# EAGLE design Set-Mile-TOP (EAGLE 9.6.2)
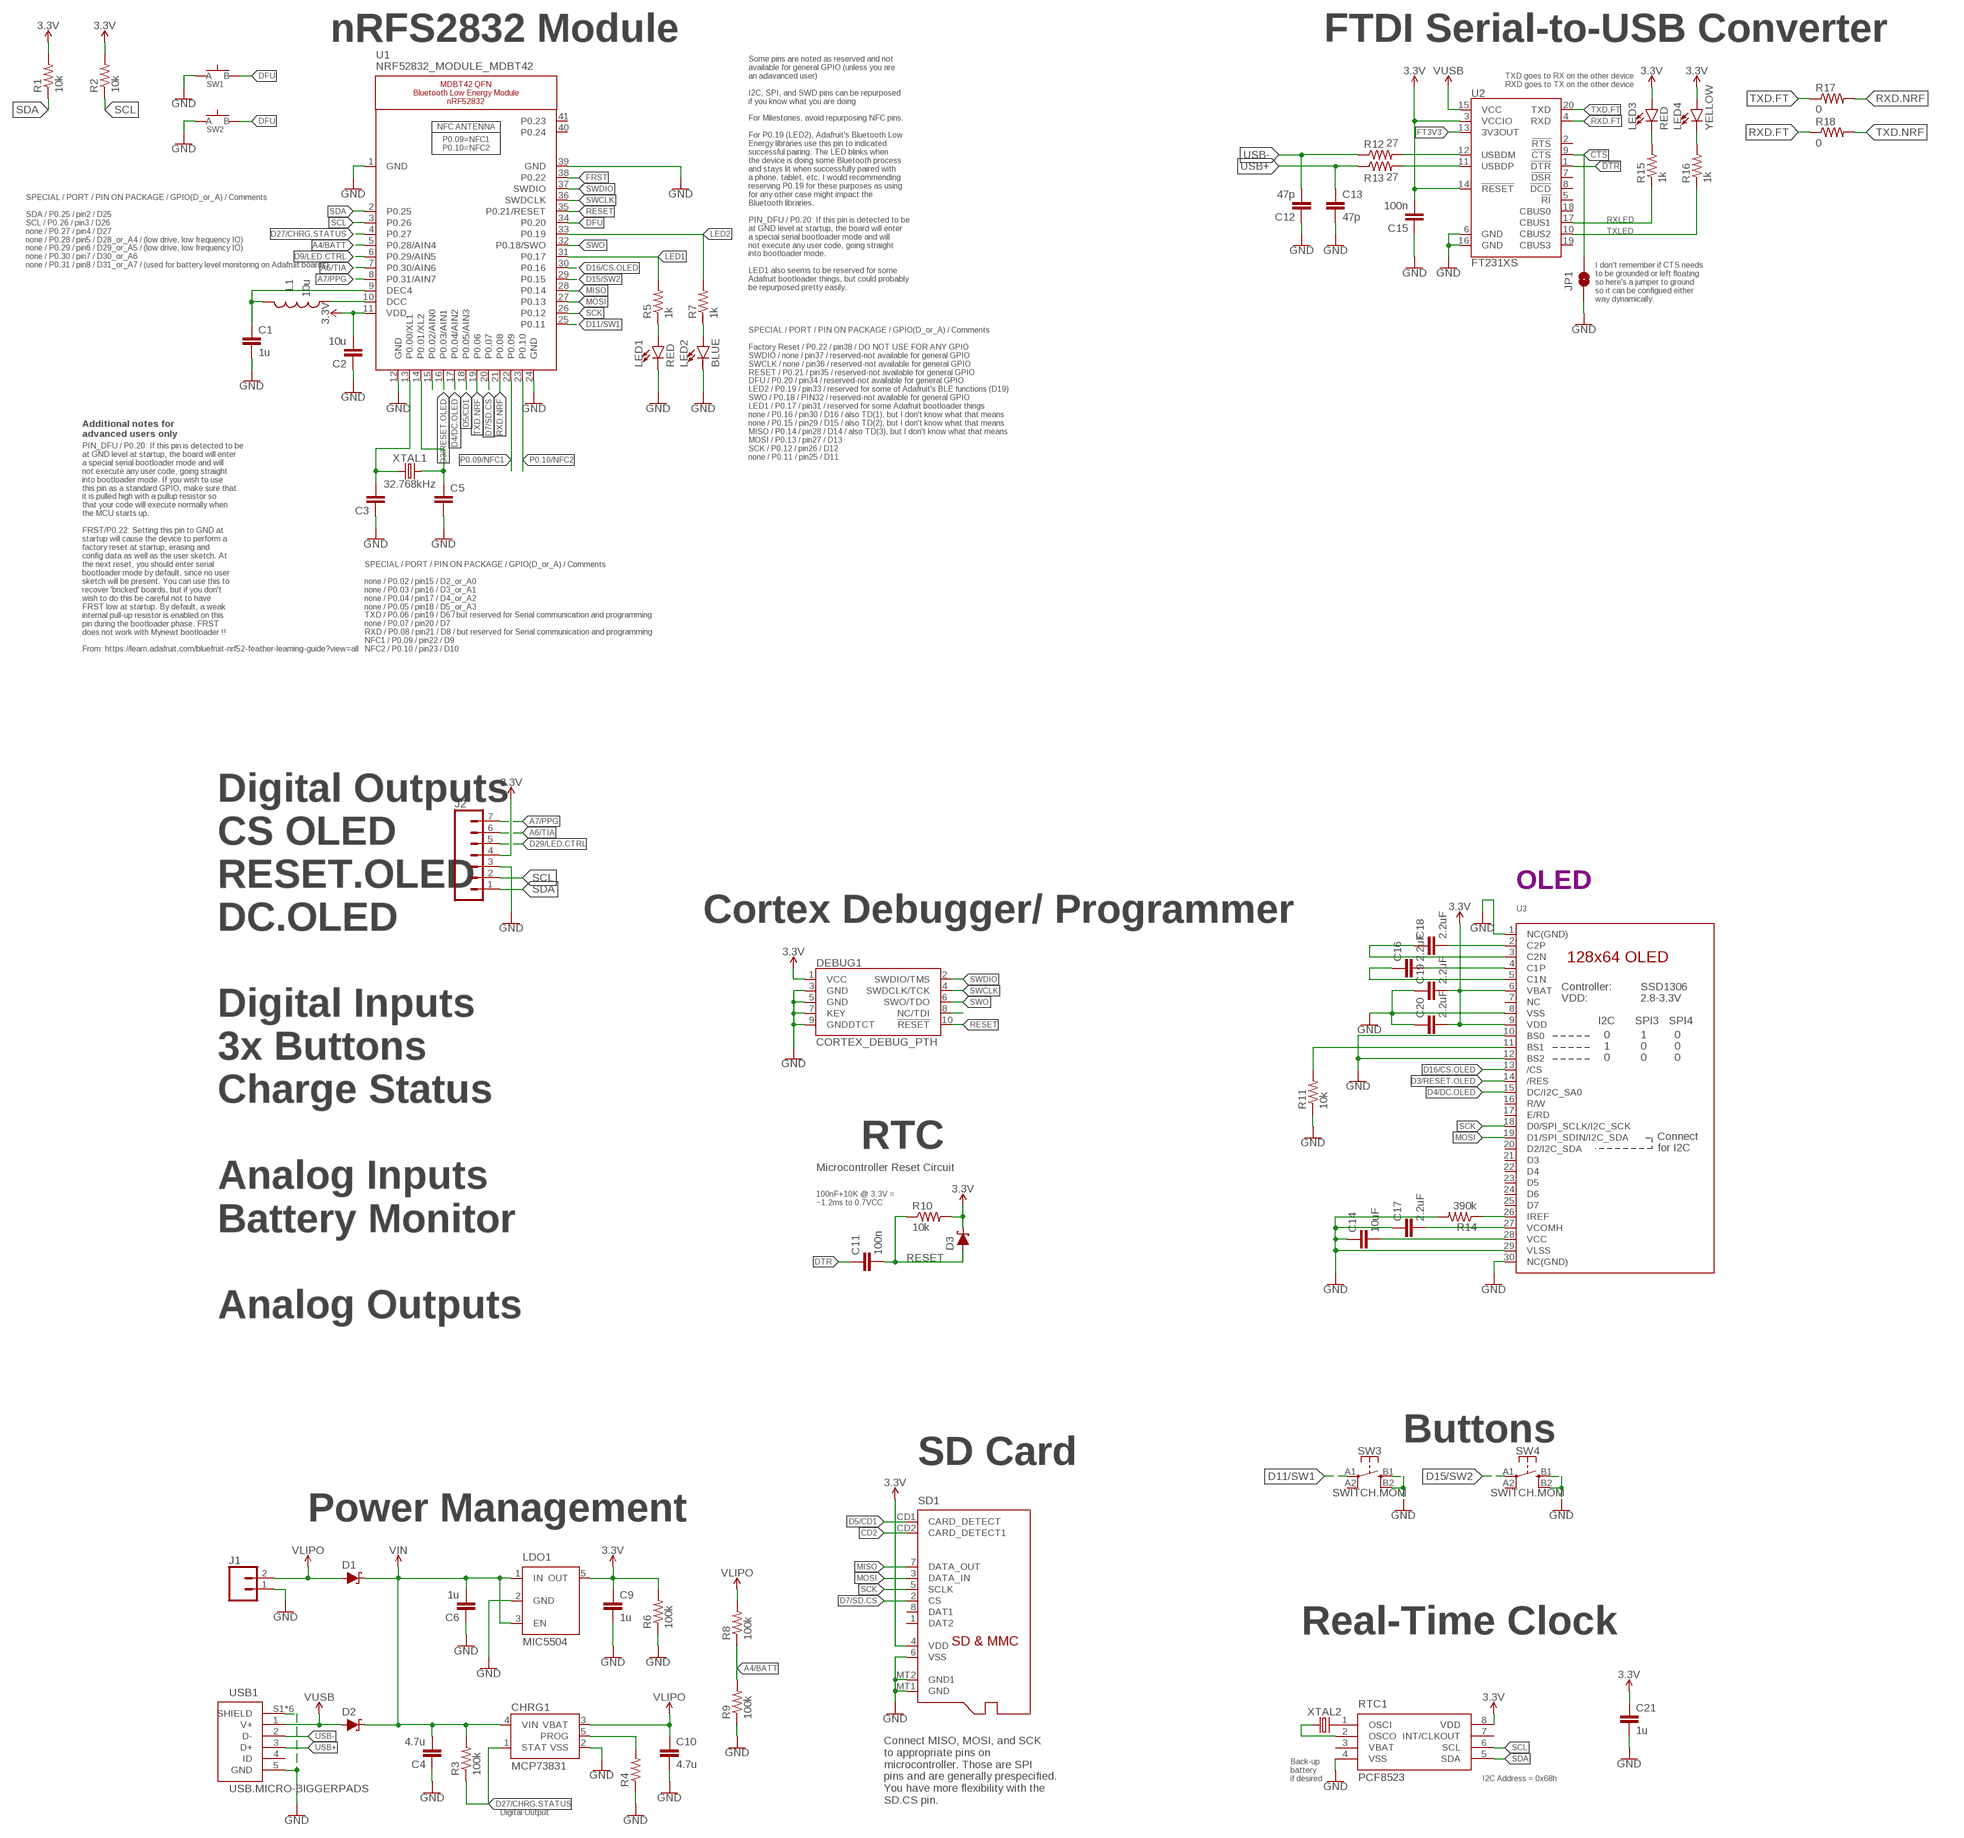
[diagram p0: schematic, sheet 1]

## Parts
C1  1u  CAPACITOR0603  [C0603]
C2  10u  CAPACITOR0805  [C0805]
C3  CAPACITOR0603  [C0603]
C4  4.7u  CAPACITOR0603  [C0603]
C5  CAPACITOR0603  [C0603]
C6  1u  CAPACITOR0603  [C0603]
C9  1u  CAPACITOR0603  [C0603]
C10  4.7u  CAPACITOR0603  [C0603]
C11  100n  CAPACITOR0603  [C0603]
C12  47p  CAPACITOR0603  [C0603]
C13  47p  CAPACITOR0603  [C0603]
C14  10uF  CAPACITOR0603  [C0603]
C15  100n  CAPACITOR0603  [C0603]
C16  2.2uF  CAPACITOR0402  [C0402]
C17  2.2uF  CAPACITOR0402  [C0402]
C18  2.2uF  CAPACITOR0402  [C0402]
C19  2.2uF  CAPACITOR0402  [C0402]
C20  2.2uF  CAPACITOR0402  [C0402]
C21  1u  CAPACITOR0603  [C0603]
CHRG1  MCP73831  [SOT23-5]
D1  SCHOTTKY-USC  [USC]
D2  SCHOTTKY-USC  [USC]
D3  SCHOTTKY-USC  [USC]
DEBUG1  CORTEX_DEBUG_PTH  [2X5-PTH-1.27MM]
J1  CONN_02  [1X02]
J2  CONN_07-1.27MM  [1X07_1.27MM]
JP1  JUMPER-SMT_2_NO_SILK  [SMT-JUMPER_2_NO_SILK]
L1  10u  INDUCTOR0603  [L0603]
LDO1  MIC5504  [SOT23-5]
LED1  RED  LED0603  [LED-0603]
LED2  BLUE  LED0603  [LED-0603]
LED3  RED  LED0603  [LED-0603]
LED4  YELLOW  LED0603  [LED-0603]
R1  10k  RESISTOR0603  [R0603]
R2  10k  RESISTOR0603  [R0603]
R3  100k  RESISTOR0603  [R0603]
R4  RESISTOR0603  [R0603]
R5  1k  RESISTOR0603  [R0603]
R6  100k  RESISTOR0603  [R0603]
R7  1k  RESISTOR0603  [R0603]
R8  100k  RESISTOR0603  [R0603]
R9  100k  RESISTOR0603  [R0603]
R10  10k  RESISTOR0603  [R0603]
R11  10k  RESISTOR0603  [R0603]
R12  27  RESISTOR0603  [R0603]
R13  27  RESISTOR0603  [R0603]
R14  390k  RESISTOR0603  [R0603]
R15  1k  RESISTOR0603  [R0603]
R16  1k  RESISTOR0603  [R0603]
R17  0  RESISTOR0603  [R0603]
R18  0  RESISTOR0603  [R0603]
RTC1  PCF8523  [SO8]
SD1  MICROSD  [MICROSD]
SW1  SPST-PTS830GG140-COPY.1-3  [BUTTON-GULLWING]
SW2  SPST-PTS830GG140-COPY.1-3  [BUTTON-GULLWING]
SW3  SWITCH.MOM  [TACTILE_SWITCH_SMD_6.2MM_TALL]
SW4  SWITCH.MOM  [TACTILE_SWITCH_SMD_6.2MM_TALL]
U1  NRF52832_MODULE_MDBT42  [BLE_MODULE_RAYTAC_MDBT42]
U2  FT231XS  [SSOP20_L]
U3  DISP_OLED_UG-2864HSWEG01-NO-WRAPAROUND  [UG-2864HSWEG01_0.96IN_NO-WRAPAROUND]
USB1  USB.MICRO-BIGGERPADS  [USB-MICRO-01.BIGGERPADS]
XTAL1  32.768kHz  CRYSTALECS-.327-12.5-12-C-TR  [2-SMD.NOLEAD.2.0MMTO1.2MM]
XTAL2  32.7680kHz  CRYSTALECS-.327-12.5-12-C-TR  [2-SMD.NOLEAD.2.0MMTO1.2MM]

## Nets
3.3V: C2.2 C9.1 C15.2 C19.2 C20.2 C21.1 D3.-(C) DEBUG1.1(VCC) J2.4 LDO1.5(OUT) LED3.A LED4.A R1.2 R2.2 R6.2 R10.2 RTC1.8(VDD) SD1.4(VDD) U1.11(VDD) U2.3(VCCIO) U2.14(!RESET) U3.6(VBAT) U3.9(VDD)
!CTS: JP1.2 U2.9(!CTS)
!DTR: U2.1(!DTR)
A4/BATT: R8.1 R9.2 U1.5(P0.28/AIN4)
A6/TIA: J2.6 U1.7(P0.30/AIN6)
A7/PPG: J2.7 U1.8(P0.31/AIN7)
CD2: SD1.CD2(CARD_DETECT1)
D3/RESET.OLED: U1.16(P0.03/AIN1) U3.14(/RES)
D4/DC.OLED: U1.15(P0.02/AIN0) U1.17(P0.04/AIN2) U3.15(DC/I2C_SA0)
D5/CD1: SD1.CD1(CARD_DETECT) U1.18(P0.05/AIN3)
D7/SD.CS: SD1.2(CS) U1.20(P0.07)
D9/LED.CTRL: U1.6(P0.29/AIN5)
D11/SW1: SW3.A1 U1.25(P0.11)
D15/SW2: SW4.A1 U1.29(P0.15)
D16/CS.OLED: U1.30(P0.16) U3.13(/CS)
D27/CHRG.STATUS: CHRG1.1(STAT) R3.1 U1.4(P0.27)
D29/LED.CTRL: J2.5
DFU: SW1.3(B) SW2.3(B) U1.34(P0.20)
DTR: C11.1
FRST: U1.38(P0.22)
FT3V3: U2.13(3V3OUT)
GND: C1.2 C2.1 C3.1 C4.1 C5.2 C6.1 C9.2 C10.2 C12.1 C13.2 C14.1 C15.1 C17.1 C19.1 C20.1 C21.2 CHRG1.2(VSS) DEBUG1.3(GND) DEBUG1.5(GND) DEBUG1.7(KEY) DEBUG1.9(GNDDTCT) J1.1 J2.3 JP1.1 LDO1.2(GND) LED1.C LED2.C R4.1 R6.1 R9.1 R11.1 R14.2 RTC1.4(VSS) SD1.6(VSS) SD1.MT1(GND) SD1.MT2(GND1) SW1.1(A) SW2.1(A) SW3.B1 SW3.B2 SW4.B1 SW4.B2 U1.1(GND) U1.12(GND) U1.24(GND) U1.39(GND) U2.6(GND) U2.16(GND) U3.1(NC(GND)) U3.8(VSS) U3.10(BS0) U3.12(BS2) U3.29(VLSS) U3.30(NC(GND)) USB1.5(GND) USB1.S1(SHIELD) USB1.S2(SHIELD) USB1.S3(SHIELD) USB1.S4(SHIELD) USB1.S5(SHIELD) USB1.S6(SHIELD)
LED1: R5.2 U1.31(P0.17)
LED2: R7.2 U1.33(P0.19)
MISO: SD1.7(DATA_OUT) U1.28(P0.14)
MOSI: SD1.3(DATA_IN) U1.27(P0.13) U3.19(D1/SPI_SDIN/I2C_SDA)
N$1: R11.2 U3.11(BS1)
N$2: R14.1 U3.26(IREF)
N$3: C18.2 U3.2(C2P)
N$4: C3.2 U1.13(P0.00/XL1) XTAL1.P$1
N$5: C18.1 U3.3(C2N)
N$6: C5.1 U1.14(P0.01/XL2) XTAL1.P$2
N$7: C16.2 U3.4(C1P)
N$8: C16.1 U3.5(C1N)
N$9: LED1.A R5.1
N$10: LED2.A R7.1
N$11: L1.1 U1.10(DCC)
N$12: C1.1 L1.2 U1.9(DEC4)
N$13: C14.2 U3.28(VCC)
N$14: DEBUG1.8(NC/TDI)
N$15: C17.2 U3.27(VCOMH)
N$17: CHRG1.5(PROG) R4.2
N$19: RTC1.2(OSCO) XTAL2.P$1
N$20: RTC1.1(OSCI) XTAL2.P$2
N$23: R12.2 U2.12(USBDM)
N$24: R13.2 U2.11(USBDP)
N$25: LED3.C R15.2
N$26: LED4.C R16.2
P0.09/NFC1: U1.22(P0.09)
P0.10/NFC2: U1.23(P0.10)
RESET: C11.2 D3.+(A) DEBUG1.10(!RESET) R10.1 U1.35(P0.21/RESET)
RXD.FT: R18.1 U2.4(RXD)
RXD.NRF: R17.2 U1.21(P0.08)
RXLED: R15.1 U2.17(CBUS1)
SCK: SD1.5(SCLK) U1.26(P0.12) U3.18(D0/SPI_SCLK/I2C_SCK)
SCL: J2.2 R2.1 RTC1.6(SCL) U1.3(P0.26)
SDA: J2.1 R1.1 RTC1.5(SDA) U1.2(P0.25)
SWCLK: DEBUG1.4(SWDCLK/TCK) U1.36(SWDCLK)
SWDIO: DEBUG1.2(SWDIO/TMS) U1.37(SWDIO)
SWO: DEBUG1.6(SWO/TDO) U1.32(P0.18/SWO)
TXD.FT: R17.1 U2.20(TXD)
TXD.NRF: R18.2 U1.19(P0.06)
TXLED: R16.1 U2.10(CBUS2)
USB+: C13.1 R13.1 USB1.3(D+)
USB-: C12.2 R12.1 USB1.2(D-)
V_USB: D2.+(A) U2.15(VCC) USB1.1(V+) ; supply symbol labelled VUSB
VIN: C4.2 C6.2 CHRG1.4(VIN) D1.-(C) D2.-(C) LDO1.1(IN) LDO1.3(EN) R3.2
VLIPO: C10.1 CHRG1.3(VBAT) D1.+(A) J1.2 R8.2
Unconnected: RTC1.3(VBAT) RTC1.7(INT/CLKOUT) SD1.1(DAT2) SD1.8(DAT1) SW3.A2 SW4.A2 U1.40(P0.24) U1.41(P0.23) U2.2(!RTS) U2.5(!RI) U2.7(!DSR) U2.8(!DCD) U2.18(CBUS0) U2.19(CBUS3) U3.7(NC) U3.16(R/W) U3.17(E/RD) U3.20(D2/I2C_SDA) U3.21(D3) U3.22(D4) U3.23(D5) U3.24(D6) U3.25(D7) USB1.4(ID)

## Notes on the sheet
- nRFS2832 Module | FTDI Serial-to-USB Converter
- TXD goes to RX on the other device
  RXD goes to TX on the other device
- SPECIAL / PORT / PIN ON PACKAGE / GPIO(D_or_A) / Comments
  
  SDA / P0.25 / pin2 / D25
  SCL / P0.26 / pin3 / D26
  none / P0.27 / pin4 / D27
  none / P0.28 / pin5 / D28_or_A4 / (low drive, low frequency IO)
  none / P0.29 / pin6 / D29_or_A5 / (low drive, low frequency IO)
  none / P0.30 / pin7 / D30_or_A6
  none / P0.31 / pin8 / D31_or_A7 / (used for battery level monitoring on Adafruit boards)
- Some pins are noted as reserved and not
  available for general GPIO (unless you are
  an adavanced user)
  
  I2C, SPI, and SWD pins can be repurposed
  if you know what you are doing
  
  For Milestones, avoid repurposing NFC pins.
  
  For P0.19 (LED2), Adafruit's Bluetooth Low
  Energy libraries use this pin to indicated
  successful pairing. The LED blinks when
  the device is doing some Bluetooth process
  and stays lit when successfully paired with
  a phone, tablet, etc. I would recommending
  reserving P0.19 for these purposes as using
  for any other case might impact the
  Bluetooth libraries.
  
  PIN_DFU / P0.20: If this pin is detected to be
  at GND level at startup, the board will enter
  a special serial bootloader mode and will
  not execute any user code, going straight
  into bootloader mode.
  
  LED1 also seems to be reserved for some
  Adafruit bootloader things, but could probably
  be repurposed pretty easily.
- I don't remember if CTS needs
  to be grounded or left floating
  so here's a jumper to ground
  so it can be configued either
  way dynamically.
- Additional notes for
  advanced users only
- SPECIAL / PORT / PIN ON PACKAGE / GPIO(D_or_A) / Comments
  
  Factory Reset / P0.22 / pin38 / DO NOT USE FOR ANY GPIO
  SWDIO / none / pin37 / reserved-not available for general GPIO
  SWCLK / none / pin36 / reserved-not available for general GPIO
  RESET / P0.21 / pin35 / reserved-not available for general GPIO
  DFU / P0.20 / pin34 / reserved-not available for general GPIO
  LED2 / P0.19 / pin33 / reserved for some of Adafruit's BLE functions (D19)
  SWO / P0.18 / PIN32 / reserved-not available for general GPIO
  LED1 / P0.17 / pin31 / reserved for some Adafruit bootloader things
  none / P0.16 / pin30 / D16 / also TD(1), but I don't know what that means
  none / P0.15 / pin29 / D15 / also TD(2), but I don't know what that means
  MISO / P0.14 / pin28 / D14 / also TD(3), but I don't know what that means
  MOSI / P0.13 / pin27 / D13
  SCK / P0.12 / pin26 / D12
  none / P0.11 / pin25 / D11
- PIN_DFU / P0.20: If this pin is detected to be
  at GND level at startup, the board will enter
  a special serial bootloader mode and will
  not execute any user code, going straight
  into bootloader mode. If you wish to use
  this pin as a standard GPIO, make sure that
  it is pulled high with a pullup resistor so
  that your code will execute normally when
  the MCU starts up.
  
  FRST/P0.22: Setting this pin to GND at
  startup will cause the device to perform a
  factory reset at startup, erasing and
  config data as well as the user sketch. At
  the next reset, you should enter serial
  bootloader mode by default, since no user
  sketch will be present. You can use this to
  recover 'bricked' boards, but if you don't
  wish to do this be careful not to have
  FRST low at startup. By default, a weak
  internal pull-up resistor is enabled on this
  pin during the bootloader phase. FRST
  does not work with Mynewt bootloader !!
  
  From: https://learn.adafruit.com/bluefruit-nrf52-feather-learning-guide?view=all
- SPECIAL / PORT / PIN ON PACKAGE / GPIO(D_or_A) / Comments
  
  none / P0.02 / pin15 / D2_or_A0
  none / P0.03 / pin16 / D3_or_A1
  none / P0.04 / pin17 / D4_or_A2
  none / P0.05 / pin18 / D5_or_A3
  TXD / P0.06 / pin19 / D6 / but reserved for Serial communication and programming
  none / P0.07 / pin20 / D7
  RXD / P0.08 / pin21 / D8 / but reserved for Serial communication and programming
  NFC1 / P0.09 / pin22 / D9
  NFC2 / P0.10 / pin23 / D10
- OLED
- Cortex Debugger/ Programmer
- RTC
- Microcontroller Reset Circuit
- 100nF+10K @ 3.3V =
  ~1.2ms to 0.7VCC
- Digital Outputs 
  CS OLED
  RESET.OLED
  DC.OLED
  
  Digital Inputs
  3x Buttons
  Charge Status
  
  Analog Inputs
  Battery Monitor
  
  Analog Outputs
- Buttons
- SD Card
- Power Management
- Real-Time Clock
- Back-up
  battery
  if desired
- I2C Address = 0x68h
- Connect MISO, MOSI, and SCK
  to appropriate pins on
  microcontroller. Those are SPI
  pins and are generally prespecified.
  You have more flexibility with the
  SD.CS pin.
- Digital Output

## Library data of the parts
C1-C6 C9-C21 = LinnesLab-Passives:CAPACITOR
CHRG1 = LinnesLab-Power:MCP73831: MCP73831T Li-Ion, Li-Pol Controller Miniature single cell, fully integrated Li-Ion, Li-polymer charge management controller Datasheet <http://ww1.microchip.com/downloads/en/DeviceDoc/20001984g.pdf> SparkFun Products: SparkFun ESP32 Thing <https://www.sparkfun.com/products/13907> SparkFun 9DoF Razor IMU M0 <https://www.sparkfun.com/products/14001>; PROD_ID: IC-09995
D1-D3 = LinnesLab-DiscreteSemi:SCHOTTKY: Schottky diode A Schottky diode is a semiconductor diode which has a low forward voltage drop and a very fast switching action. Example: Digi-Key Part Number: RB161MM-20CT-ND
DEBUG1 = LinnesLab-Connectors:CORTEX_DEBUG: Cortex Debug Connector - 10 pin Supports JTAG debug, Serial Wire debug, and Serial Wire Viewer. PTH and SMD connector options available. General Connector Information <http://infocenter.arm.com/help/topic/com.arm.doc.faqs/attached/13634/cortex_debug_connectors.pdf> Products: PTH Connector <http://www.digikey.com/product-detail/en/cnc-tech/3220-10-0100-00/1175-1627-ND/3883661> -via Digi-Key SparkFun PSoc <https://www.sparkfun.com/products/13229> SparkFun T <https://www.sparkfun.com/products/13810>
J1 = LinnesLab-Connectors:CONN_02: Multi connection point. Often used as Generic Header-pin footprint for 0.1 inch spaced/style header connections On any of the 0.1 inch spaced packages, you can populate with these: Break Away Headers - Straight <https://www.sparkfun.com/products/116> (PRT-00116) Break Away Male Headers - Right Angle <https://www.sparkfun.com/products/553> (PRT-00553) Female Headers <https://www.sparkfun.com/products/115> (PRT-00115) Break Away Headers - Machine Pin <https://www.sparkfun.com/products/117> (PRT-00117) Break Away Female Headers - Swiss Machine Pin <https://www.sparkfun.com/products/743> (PRT-00743) For SCREWTERMINALS and SPRING TERMINALS visit here: Screw Terimnals on SparkFun.com <https://www.sparkfun.com/search/results?term=Screw+Terminals> (5mm/3.5mm/2.54mm spacing) This device is also useful as a general connection point to wire up your design to another part of your project. Our various solder wires solder well into these plated through hole pads. Hook-Up Wire - Assortment (Stranded, 22 AWG) <https://www.sparkfun.com/products/11375> (PRT-11375) Hook-Up Wire - Assortment (Solid Core, 22 AWG) <https://www.sparkfun.com/products/11367> (PRT-11367) View the entire wire category on our website here <https://www.sparkfun.com/categories/141> Special notes: Molex polarized connector foot print use with: PRT-08233 with associated crimp pins and housings. 2.54_SCREWTERM for use with PRT-10571. 3.5mm Screw Terminal footprints for PRT-08084 5mm Screw Terminal footprints for use with PRT-08432
J2 = LinnesLab-Connectors:CONN_07: Multi connection point. Often used as Generic Header-pin footprint for 0.1 inch spaced/style header connections On any of the 0.1 inch spaced packages, you can populate with these: Break Away Headers - Straight <https://www.sparkfun.com/products/116> (PRT-00116) Break Away Male Headers - Right Angle <https://www.sparkfun.com/products/553> (PRT-00553) Female Headers <https://www.sparkfun.com/products/115> (PRT-00115) Break Away Headers - Machine Pin <https://www.sparkfun.com/products/117> (PRT-00117) Break Away Female Headers - Swiss Machine Pin <https://www.sparkfun.com/products/743> (PRT-00743) For SCREWTERMINALS and SPRING TERMINALS visit here: Screw Terimnals on SparkFun.com <https://www.sparkfun.com/search/results?term=Screw+Terminals> (5mm/3.5mm/2.54mm spacing) This device is also useful as a general connection point to wire up your design to another part of your project. Our various solder wires solder well into these plated through hole pads. Hook-Up Wire - Assortment (Stranded, 22 AWG) <https://www.sparkfun.com/products/11375> (PRT-11375) Hook-Up Wire - Assortment (Solid Core, 22 AWG) <https://www.sparkfun.com/products/11367> (PRT-11367) View the entire wire category on our website here <https://www.sparkfun.com/categories/141> Special notes: Molex polarized connector foot print use with SKU : PRT-08231 with associated crimp pins and housings. 1MM SMD Version SKU: PRT-10208 NOTES ON THE VARIANTS LOCK and LOCK_LONGPADS... This footprint was designed to help hold the alignment of a through-hole component (i.e. 6-pin header) while soldering it into place. You may notice that each hole has been shifted either up or down by 0.005 of an inch from it's more standard position (which is a perfectly straight line). This slight alteration caused the pins (the squares in the middle) to touch the edges of the holes. Because they are alternating, it causes a "brace" to hold the component in place. 0.005 has proven to be the perfect amount of "off-center" position when using our standard breakaway headers. Although looks a little odd when you look at the bare footprint, once you have a header in there, the alteration is very hard to notice. Also,if you push a header all the way into place, it is covered up entirely on the bottom side.
JP1 = LinnesLab-Switches:JUMPER-SMT_2_NO: Normally open jumper This jumper has two pads in close proximity to each other. Apply solder to close the connection. Round pads are easier to solder for beginners, but are a lot larger. SparkFun Product that uses the round pads: SparkFun EL Sequencer <https://www.sparkfun.com/products/12781>
L1 = LinnesLab-Passives:INDUCTOR
LDO1 = LinnesLab-Power:MIC5504: MIC5504 Voltage Regulator Output Voltages: 1.0V to 3.3V Input Voltages: 2.5V to 5.5V Link to Datasheet http://ww1.microchip.com/downloads/en/DeviceDoc/MIC550X.pdf
LED1-LED4 = LinnesLab-LED:LED: LED (Generic) Standard schematic elements and footprints for 5mm, 3mm, 1206, and 0603 sized LEDs. Generic LEDs with no color specified. LTST-C190KGKT: arrow indicates cathode
R1-R18 = LinnesLab-Passives:RESISTOR
RTC1 = LinnesLab-Clocks:PCF8523; DIGIKEY: 568-5306-1-ND; I2C_ADDRESS: 0x68h; MFN: PCF8523T/1,118; MFN_MANUFACTURER: NXP USA Inc.
SD1 = LinnesLab-Connectors:MICROSD: Micro-SD / Transflash card holder with SPI pinout For the 3M # 2908-05WB-MG and/or 4UCON #19656 push-push type
SW1 SW2 = LinnesLab-Switches:SPST-PTS830GG140-COPY
SW3 SW4 = LinnesLab-Switches:SWITCH.MOM: PTS645SM43SMTR92 LFS
U1 = LinnesLab-Microcontrollers:NRF52832_MODULE_MDBT42: MDBT42 - BLE Module (nRF52832 QFN) VDD: 1.7-3.6V
U2 = LinnesLab-DigitalIC:FT231X: FTDI FT231X Full Speed USB to Full-handshake UART This USB2.0 Full Speed IC offers a compact bridge to full handshake UART interfaces. The device is a UART, capable of operating up to 3MBaud, with low power consumption (8mA). The FT231X includes the complete FT-X series feature set and enables USB to be added into a system design quickly and easily over a UART interface. Datasheet <http://cdn.sparkfun.com/datasheets/Components/General%20IC/DS_FT231X.pdf> SparkFun Products SparkFun RedBoard - Programmed with Arduino <https://www.sparkfun.com/products/12757> (DEV-12757) SparkFun XBee Explorer USB <https://www.sparkfun.com/products/11812> (WRL-11812) SparkFun XBee Explorer Dongle <https://www.sparkfun.com/products/11697> (WRL-11697) SparkFun Blynk Board - ESP8266 <https://www.sparkfun.com/products/13794> (WRL-13794) SparkFun ESP8266 Thing - Dev Board <https://www.sparkfun.com/products/13711> (WRL-13711) SparkFun Block for Intel® Edison - Base <https://www.sparkfun.com/products/13045> (DEV-13045) SparkFun RedStick <https://www.sparkfun.com/products/13741> (DEV-13741) SparkFun Beefy 3 - FTDI Basic Breakout <https://www.sparkfun.com/products/13746> (DEV-13746) SparkFun FT231X Breakout <https://www.sparkfun.com/products/11736> (BOB-11736); PROD_ID: IC-11524
U3 = LinnesLab-Displays:DISP_OLED_UG-2864HSWEG01: UG-2864HSWEG01 OLED display Both 1.3" and 0.96" models share the same FPC tab footprint, only the screen dimensions vary.
USB1 = LinnesLab-Connectors:USB.MICRO: DigiKey PN: 609-4613-1-ND
XTAL1 XTAL2 = LinnesLab-Clocks:CRYSTAL

## Board
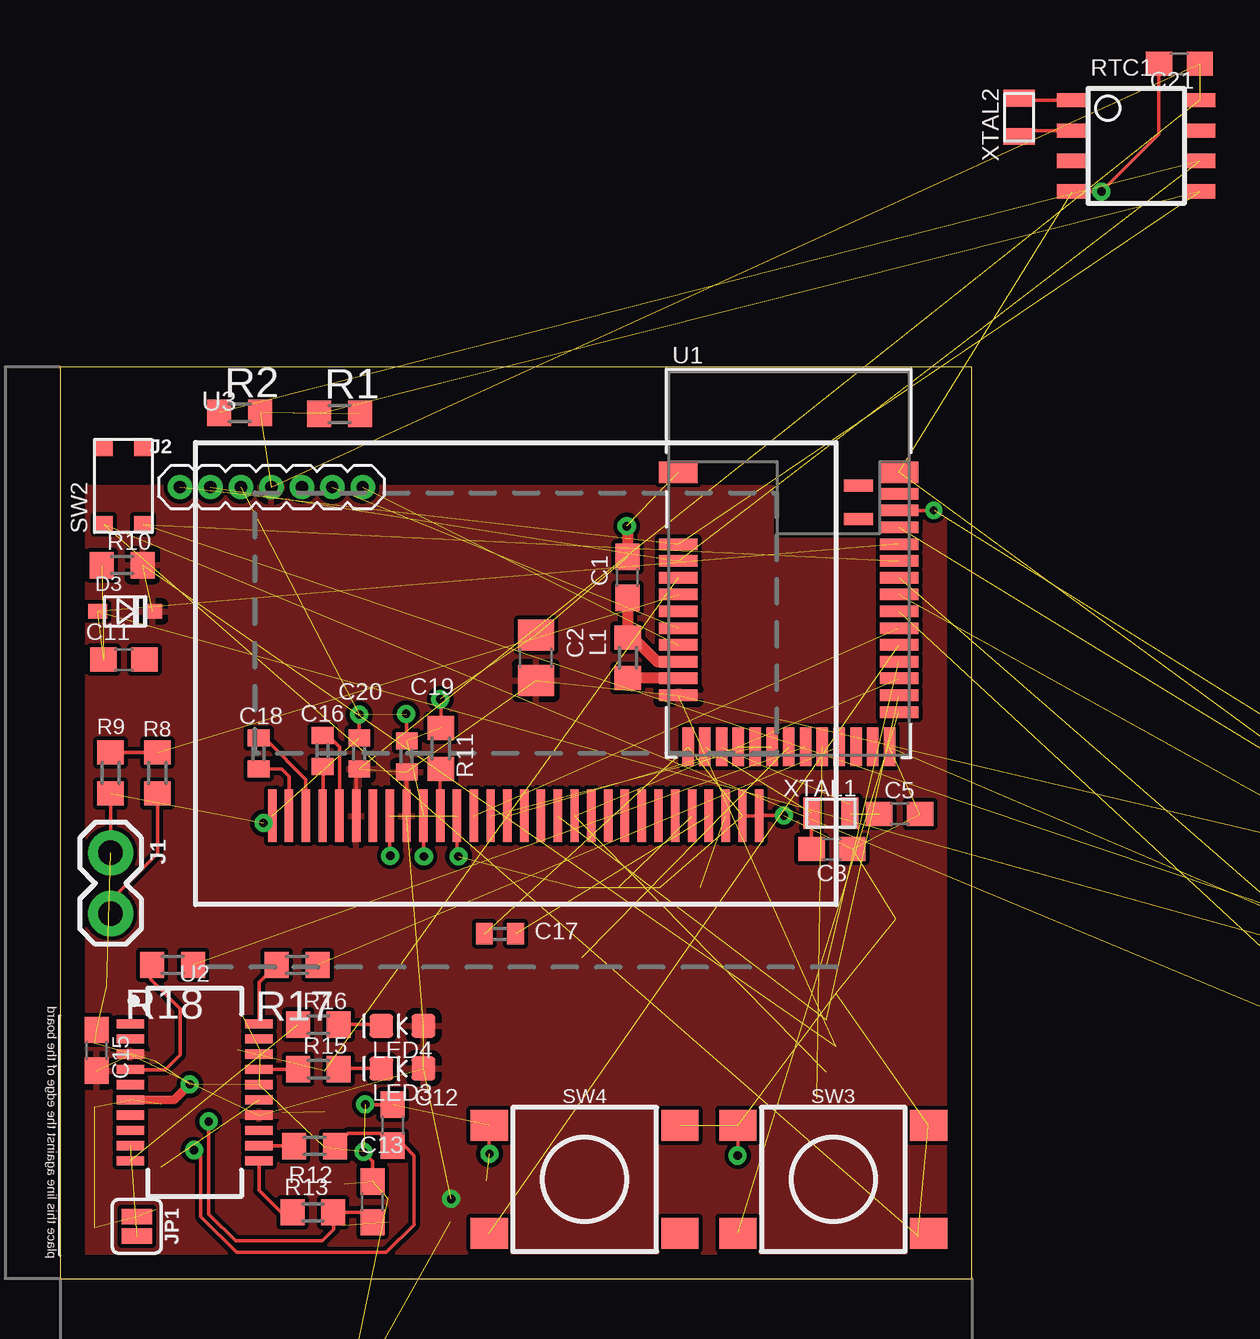
[diagram p1: board, top side]
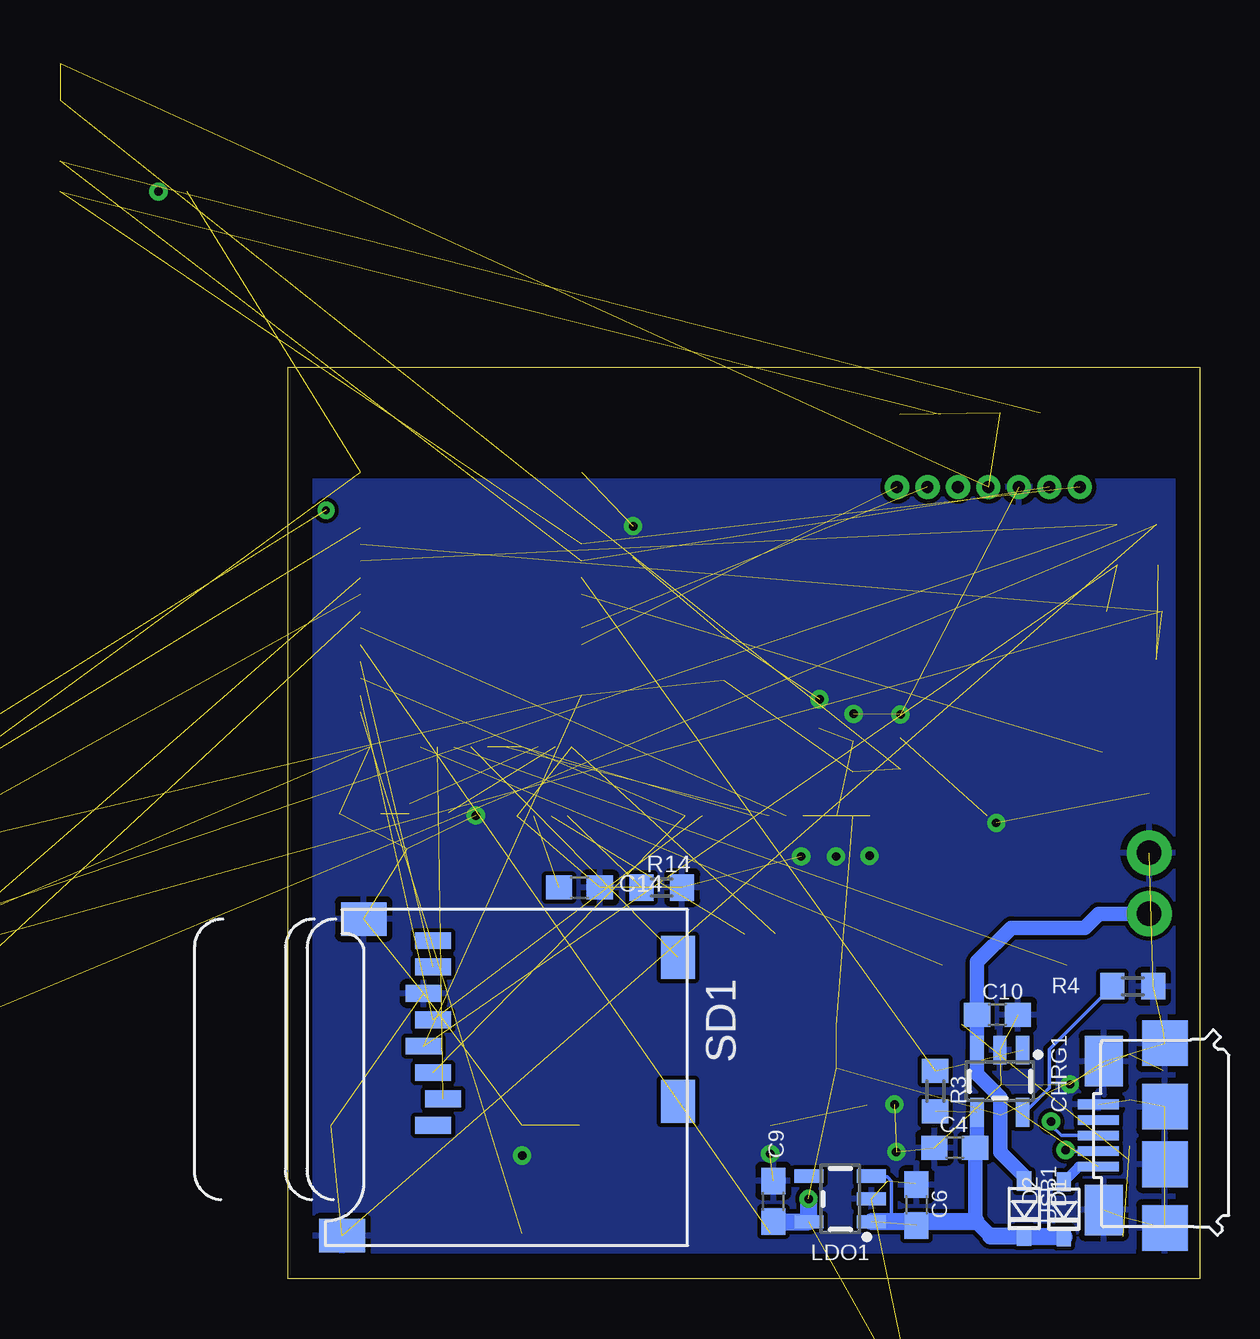
[diagram p2: board, bottom side, seen from below]

Size 38 x 38 mm. Coordinates in mm from the lower left corner, seen from the top.
Outline: 0,0 38,0 38,38 0,38 0,0
Copper layers (1*16): Top 0.035mm / dielectric 1.5mm / Bottom 0.035mm
Design rules "default": minimum track width 6mil, minimum drill 0.35mm, track to track 6mil, track to pad 6mil, pad to pad 6mil, via to via 6mil, smd to smd 6mil, copper to edge 40mil, drill to drill 6mil, minimum pad ring 10mil, minimum via ring 8mil, stop-mask expansion 4mil, vias tented up to drill 0mil, thermal gap 10mil

### Footprints (pad centres in the part's own frame; a part is rotated, then mirrored left to right if it is on the bottom)
C0603 = smd 1.1 x 1: 1 -0.85,0; 2 0.85,0
C0805 = smd 1.3 x 1.5: 1 -0.95,0; 2 0.95,0
C0402 = smd 0.7 x 0.9: 1 -0.65,0; 2 0.65,0
SOT23-5 = smd 0.55 x 1.2: 1 -0.95,-1.3; 2 0,-1.3; 3 0.95,-1.3; 4 0.95,1.3; 5 -0.95,1.3
USC = smd 0.8 x 0.6: + -1.15,0; - 1.15,0
2X5-PTH-1.27MM = drill 0.508 pad 1: 1 -2.54,-0.635; 2 -2.54,0.635; 3 -1.27,-0.635; 4 -1.27,0.635; 5 0,-0.635; 6 0,0.635; 7 1.27,-0.635; 8 1.27,0.635; 9 2.54,-0.635; 10 2.54,0.635
1X02 = drill 1.016 pad 1.88: 1 0,0; 2 2.54,0
1X07_1.27MM = drill 0.508 pad 1: 1 0,0; 2 1.27,0; 3 2.54,0; 4 3.81,0; 5 5.08,0; 6 6.35,0; 7 7.62,0
SMT-JUMPER_2_NO_SILK = smd 0.635 x 1.27: 1 -0.406,0; 2 0.406,0
L0603 = smd 1 x 1.1: 1 -0.85,0; 2 0.85,0
LED-0603 = smd 1 x 1: A -0.877,0; C 0.877,0
R0603 = smd 1 x 1.1: 1 -0.85,0; 2 0.85,0
SO8 = smd 1.3 x 0.6: 1 -2.65,1.905; 2 -2.65,0.635; 3 -2.65,-0.635; 4 -2.65,-1.905; 5 2.65,-1.905; 6 2.65,-0.635; 7 2.65,0.635; 8 2.65,1.905
MICROSD = smd 0.7 x 1.5: 1 9,-10.64; 2 7.9,-10.24; 3 6.8,-10.64; 4 5.7,-11.04; 5 4.6,-10.64; 6 3.5,-11.04; 7 2.4,-10.64; 8 1.3,-10.64 | smd 1.8 x 1.4: CD1 2,-0.44; CD2 8,-0.44 | smd 1.4 x 1.9: MT1 0.4,-13.54; MT2 13.6,-14.44
BUTTON-GULLWING = smd 0.7 x 0.75: 1 -1.6,0.825; 2 1.6,0.825; 3 -1.6,-0.825; 4 1.6,-0.825
TACTILE_SWITCH_SMD_6.2MM_TALL = smd 1.55 x 1.3: A1 -3.975,-2.25; A2 3.975,-2.25; B1 -3.975,2.25; B2 3.975,2.25
BLE_MODULE_RAYTAC_MDBT42 = smd 1.6 x 0.9: 1 -4.6,3.8; 39 4.6,3.8 | smd 1.6 x 0.48: 2 -4.6,0.8; 3 -4.6,0.1; 4 -4.6,-0.6; 5 -4.6,-1.3; 6 -4.6,-2; 7 -4.6,-2.7; 8 -4.6,-3.4; 9 -4.6,-4.1; 10 -4.6,-4.8; 11 -4.6,-5.5; 25 4.6,-6.2; 26 4.6,-5.5; 27 4.6,-4.8; 28 4.6,-4.1; 29 4.6,-3.4; 30 4.6,-2.7; 31 4.6,-2; 32 4.6,-1.3; 33 4.6,-0.6; 34 4.6,0.1; 35 4.6,0.8; 36 4.6,1.5; 37 4.6,2.2; 38 4.6,2.9 | smd 0.48 x 1.6: 12 -4.2,-7.65; 13 -3.5,-7.65; 14 -2.8,-7.65; 15 -2.1,-7.65; 16 -1.4,-7.65; 17 -0.7,-7.65; 18 0,-7.65; 19 0.7,-7.65; 20 1.4,-7.65; 21 2.1,-7.65; 22 2.8,-7.65; 23 3.5,-7.65; 24 4.2,-7.65 | smd 1.2 x 0.5: 40 2.9,3.25; 41 2.9,1.85
SSOP20_L = smd 0.381 x 1.143: 1 -2.857,-2.68; 2 -2.223,-2.68; 3 -1.587,-2.68; 4 -0.953,-2.68; 5 -0.318,-2.68; 6 0.318,-2.68; 7 0.953,-2.68; 8 1.587,-2.68; 9 2.223,-2.68; 10 2.857,-2.68; 11 2.857,2.68; 12 2.223,2.68; 13 1.587,2.68; 14 0.953,2.68; 15 0.318,2.68; 16 -0.318,2.68; 17 -0.953,2.68; 18 -1.587,2.68; 19 -2.223,2.68; 20 -2.857,2.68
UG-2864HSWEG01_0.96IN_NO-WRAPAROUND = smd 0.35 x 2.2: 1 -10.15,-1.2; 2 -9.45,-1.2; 3 -8.75,-1.2; 4 -8.05,-1.2; 5 -7.35,-1.2; 6 -6.65,-1.2; 7 -5.95,-1.2; 8 -5.25,-1.2; 9 -4.55,-1.2; 10 -3.85,-1.2; 11 -3.15,-1.2; 12 -2.45,-1.2; 13 -1.75,-1.2; 14 -1.05,-1.2; 15 -0.35,-1.2; 16 0.35,-1.2; 17 1.05,-1.2; 18 1.75,-1.2; 19 2.45,-1.2; 20 3.15,-1.2; 21 3.85,-1.2; 22 4.55,-1.2; 23 5.25,-1.2; 24 5.95,-1.2; 25 6.65,-1.2; 26 7.35,-1.2; 27 8.05,-1.2; 28 8.75,-1.2; 29 9.45,-1.2; 30 10.15,-1.2
USB-MICRO-01.BIGGERPADS = smd 0.4 x 1.7: 1 -1.3,1.505; 2 -0.65,1.505; 3 0,1.505; 4 0.65,1.505; 5 1.3,1.505 | smd 1.9 x 1.9: S1 -3.85,-1.27; S2 -1.2,-1.27; S3 1.2,-1.27; S4 3.85,-1.27 | smd 2.1 x 1.6: S5 -3.1,1.28; S6 3.1,1.28
2-SMD.NOLEAD.2.0MMTO1.2MM = smd 0.7 x 1.3: P$1 -0.8,0; P$2 0.8,0

### Placement (x,y rotation side)
C1  23.65,29.24 90 top
C2  19.84,25.88 270 top
C3  32.18,17.91 180 top
C4  10.21,5.46 0 bottom
C5  35,19.38 0 top
C6  11.81,3.07 270 bottom
C9  17.78,3.23 90 bottom
C10  8.43,11 0 bottom
C11  2.67,25.81 180 top
C12  13.87,6.4 270 top
C13  13.03,3.2 90 top
C14  25.86,16.31 180 bottom
C15  1.52,9.53 270 top
C16  10.95,22 270 top
C17  18.34,14.38 0 top
C18  8.28,21.89 270 top
C19  14.45,21.77 270 top
C20  12.47,21.89 270 top
C21  46.66,50.65 180 top  (outside the outline)
CHRG1  8.33,8.23 180 bottom
D1  7.32,2.92 270 bottom
D2  5.66,2.9 270 bottom
D3  2.72,27.81 0 top
DEBUG1  61.26,13.59 270 top  (outside the outline)
J1  2.11,17.75 270 top
J2  5,33 0 top
JP1  3.2,2.18 270 top
L1  23.67,25.88 90 top
LDO1  14.99,3.33 90 bottom
LED1  63.22,5.49 0 top  (outside the outline)
LED2  63.22,8.23 0 top  (outside the outline)
LED3  14.27,8.76 180 top
LED4  14.27,10.54 180 top
R1  11.66,36.04 0 top
R2  7.49,36.09 0 top
R3  11.02,7.82 270 bottom
R4  2.79,12.19 180 bottom
R5  59.94,5.49 180 top  (outside the outline)
R6  11.28,-7.42 90 top  (outside the outline)
R7  59.94,8.2 180 top  (outside the outline)
R8  4.06,21.08 270 top
R9  2.11,21.08 90 top
R10  2.59,29.74 0 top
R11  15.88,22.1 270 top
R12  10.62,5.54 180 top
R13  10.54,2.77 180 top
R14  22.43,16.31 0 bottom
R15  10.77,8.74 0 top
R16  10.77,10.59 0 top
R17  9.88,13.08 0 top
R18  4.7,13.08 0 top
RTC1  44.86,47.22 0 top  (outside the outline)
SD1  21.31,15.39 270 bottom
SW1  67.18,11.23 0 top  (outside the outline)
SW2  2.64,33.05 90 top
SW3  32.23,4.14 0 top
SW4  21.87,4.14 0 top
U1  30.38,29.82 0 top
U2  5.61,7.77 270 top
U3  19,20.5 0 top
USB1  2.72,5.97 90 bottom
XTAL1  32.13,19.41 0 top
XTAL2  39.98,48.41 90 top  (outside the outline)

### Tracks (layer width: path | path; a pad name or v marks a point on that pad's centre or on a via)
3.3V  (via drill 0.35)  (19 unrouted)
  Top 0.152: C19.2 14.45,19.54 14.48,19.44 U3.9 | C20.2 12.35,21.12 U3.6
  Bottom 0.711: C9.1 LDO1.5 16.29,3.31 v16.31,3.33
  pour Top (isolate 0.178): 0.38,33.02 37.87,33.02 37.87,0.51 0.38,0.51
!CTS  (1 unrouted)
A4/BATT  (1 unrouted)
  Top 0.152: R9.2 R8.1
A6/TIA  (1 unrouted)
A7/PPG  (1 unrouted)
D3/RESET.OLED  (1 unrouted)
D4/DC.OLED  (2 unrouted)
D5/CD1  (1 unrouted)
D7/SD.CS  (1 unrouted)
D11/SW1  (1 unrouted)
D15/SW2  (1 unrouted)
D16/CS.OLED  (1 unrouted)
D27/CHRG.STATUS  (2 unrouted)
DFU  (2 unrouted)
GND  (via drill 0.35)  (57 unrouted)
  Top 0.152: U3.1 8.48,18.97 v8.48,19 | v12.47,23.52 C20.1 | v14.43,23.55 14.45,23.52 C19.1 | U3.8 13.75,17.64 v13.77,17.63 | R11.1 15.88,24.13 v15.85,24.16 | U3.10 15.16,19.23 v15.16,17.6 | U3.12 16.56,19.29 16.56,17.65 v16.61,17.6 | U3.29 U3.30 v30.18,19.3 | RTC1.4 v43.41,45.31 45.81,47.72 C21.2 | SW4.B1 17.89,5.22 v17.91,5.21 | SW3.B1 28.26,5.14 v28.25,5.13 | C12.1 v12.74,7.25 v12.72,7.26 | C13.2 13.03,4.9 v12.65,5.28 | R9.1 J1.1
  Top 0.356: U2.6 4.76,7.46 v5.41,8.1
  Top 0.457: v23.62,31.37 23.65,31.34 C1.2
  Bottom 0.711: C6.1 11.85,3.96
  pour Bottom (isolate 0.178): 0.86,33.3 37.97,33.3 37.97,1.12 0.86,1.12
LED1  (1 unrouted)
LED2  (1 unrouted)
MISO  (1 unrouted)
MOSI  (2 unrouted)
N$1
  Top 0.152: R11.2 15.85,21.22 U3.11
N$2  (1 unrouted)
N$3
  Top 0.152: C18.2 9.23,21.25 9.55,20.93 U3.2
N$4  (1 unrouted)
  Top 0.152: XTAL1.P$1 C3.2
N$5
  Top 0.152: C18.1 8.37,22.45 8.61,22.45 10.25,20.82 U3.3
N$6  (2 unrouted)
  Top 0.152: 32.93,19.79 XTAL1.P$2 32.96,19.38
N$7
  Top 0.152: C16.2 10.97,21.32 10.97,19.28 U3.4
N$8
  Top 0.152: U3.5 11.65,22.17 11.18,22.65 C16.1 10.92,22.65
N$9  (1 unrouted)
N$10  (1 unrouted)
N$11
  Top 0.457: U1.10 25.77,25.03 L1.1
N$12
  Top 0.457: U1.9 24.89,25.72 23.88,26.73 L1.2 23.65,26.76 C1.1
N$13  (1 unrouted)
N$15  (1 unrouted)
N$17
  Bottom 0.152: R4.2 6.27,9.56 6.27,7.95 7.29,6.93 CHRG1.5
N$19
  Top 0.152: RTC1.2 40.22,47.85 XTAL2.P$1
N$20
  Top 0.152: RTC1.1 40.07,49.12 XTAL2.P$2
N$23
  Top 0.152: U2.12 8.31,5.54 R12.2
N$24
  Top 0.152: U2.11 8.29,3.7 9.22,2.77 R13.2
N$25
  Top 0.152: LED3.C 11.64,8.76 R15.2
N$26
  Top 0.152: LED4.C 13.35,10.59 R16.2
RESET  (4 unrouted)
RXD.FT
  Top 0.152: R18.1 3.79,13.02 3.79,12.47 5,11.25 5,9.32 4.39,8.71 2.95,8.71 U2.4
RXD.NRF  (1 unrouted)
RXLED
  Top 0.152: R15.1 9.91,8.72 U2.17
SCK  (2 unrouted)
SCL  (3 unrouted)
SDA  (3 unrouted)
SWCLK  (1 unrouted)
SWDIO  (via drill 0.3)  (1 unrouted)
  Top 0.152: U1.37 v36.41,32.02 v36.42,32.03
SWO  (1 unrouted)
TXD.FT
  Top 0.152: R17.1 8.29,12.34 U2.20
TXD.NRF  (1 unrouted)
TXLED  (1 unrouted)
  Top 0.152: U2.10 2.95,4.93
USB+  (via drill 0.35)
  Top 0.152: C13.1 12.61,2.77 R13.1 11.42,2.74 11.42,2.06 10.93,1.57 7.32,1.57 6.2,2.69 v6.2,6.55
  Bottom 0.152: USB1.3 5.77,5.97 6.2,6.4 v6.2,6.55
USB-  (via drill 0.35)
  Top 0.152: R12.1 12,6.07 13.35,6.07 C12.2 14.34,5.55 14.76,5.13 14.76,2.25 13.6,1.09 7.37,1.09 5.87,2.59 5.87,5.08 v5.59,5.36
  Bottom 0.152: USB1.2 5.55,5.32 v5.59,5.36
V_USB  (1 unrouted)
  Bottom 0.406: D2.+ 5.06,4.65 5.05,4.67 USB1.1
VIN  (2 unrouted)
  Bottom 0.152: LDO1.3 13.65,4.24 13.03,4.24 12.85,4.06 12.85,2.38
  Bottom 0.61: 8.71,1.77 9.32,2.38 9.36,2.42 C4.2 9.28,5.54 CHRG1.4
  Bottom 0.711: D2.- 5.69,1.77 D1.- 8.71,1.77 | 9.32,2.38 12.85,2.38 LDO1.1
VLIPO
  Top 0.152: J1.2 2.11,15.77 4.06,17.73 R8.2
  Bottom 0.61: J1.2 4.22,15.21 4.8,14.63 7.85,14.63 9.28,13.2 C10.1 CHRG1.3 9.28,8.54 8.31,7.57 8.31,5.27 7.32,4.28 D1.+